# Altium project 4S SMART BMS.PrjPcb (part 4 of 6)
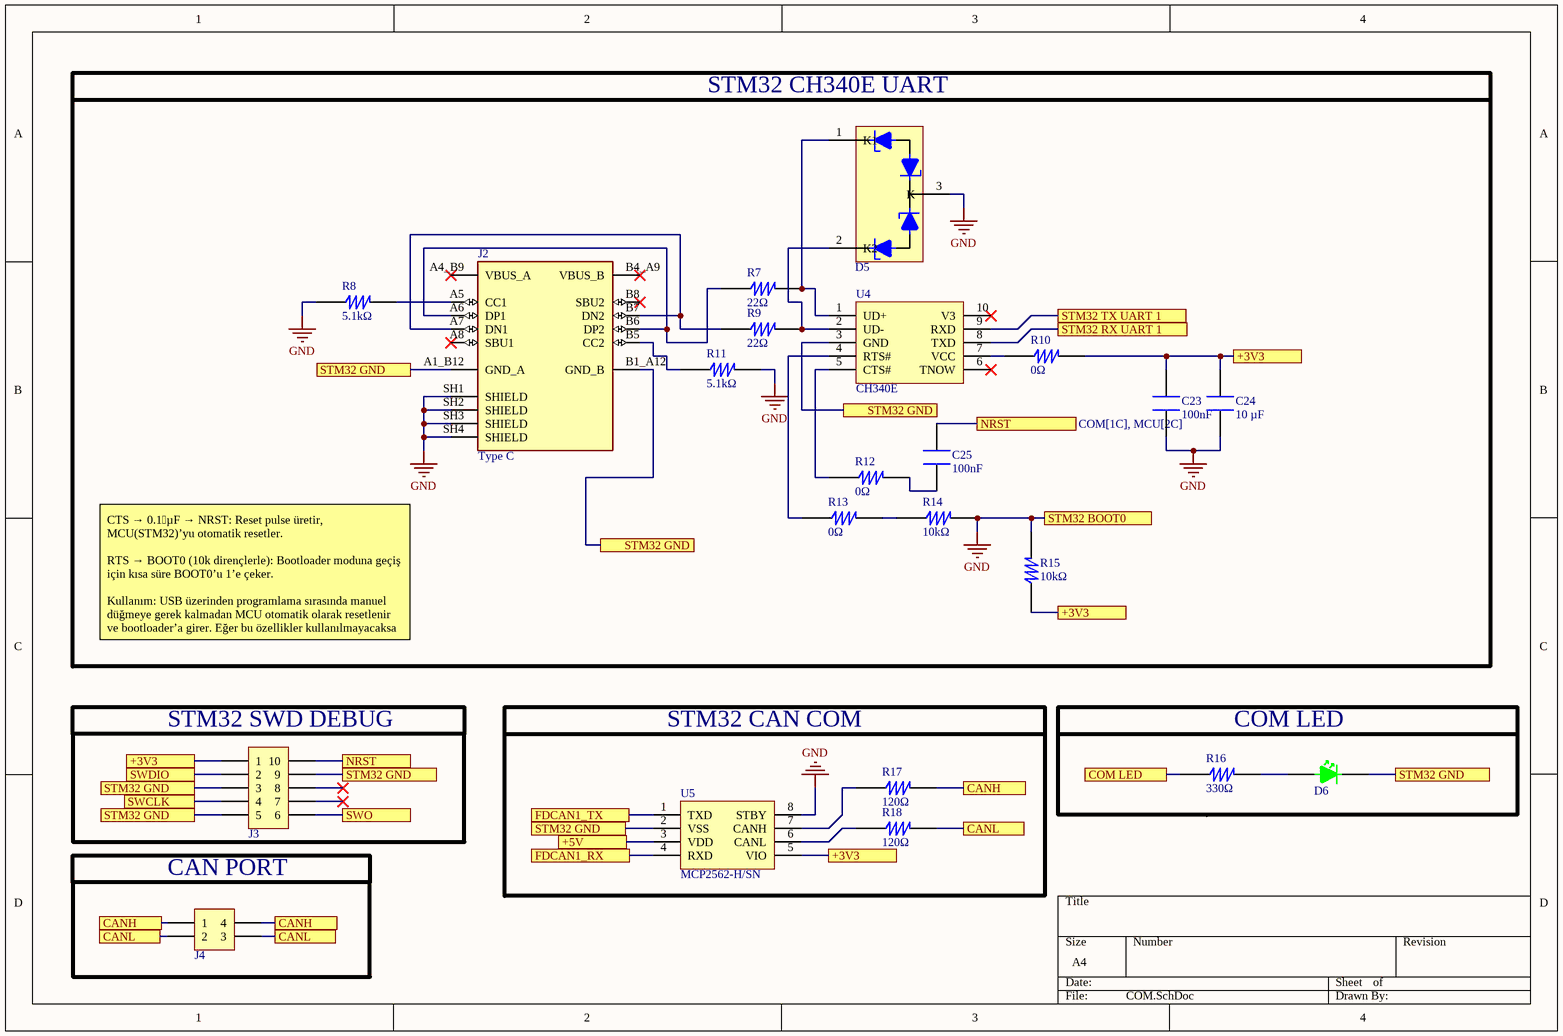
[diagram p8: COM.SchDoc]

## Sheet COM.SchDoc (continued)

### Library data of the parts
C23 C25 = CAP CER 0.1UF 6.3V 0603: 0.1 µF ±5% 6.3V Ceramic Capacitor X7R 0603 (1608 Metric); Manufacturer: KYOCERA AVX; Supplier: Arrow Electronics; Supplier Part Number: KGM15AR70J104JT; Manufacturer Part Number: KGM15AR70J104JT; RoHS: Compliant; Category: Ceramic Capacitors; Stock: 2087; Pricing: 1=0,019, 10=0,019, 25=0,019, 100=0,018, 250=0,018, 500=0,018, 1000=0,018 (USD); Dielectric Material: Ceramic; Height: 900µm; Length: 1.6mm; Lifecycle Status: Production; Max Operating Temperature: 125°C; Min Operating Temperature: -55°C; Mounting Technology: Surface Mount; Number of Terminals: 2; REACH SVHC: Yes; Voltage Rating (DC): 6.3V; Width: 810µm; ComponentLink1URL: https://datasheet.octopart.com:443/KGM15AR70J104JT-KYOCERA-AVX-datasheet-179280988.pdf?src-supplier=IHS; ComponentLink1Description: https://datasheet.octopart.com:443/KGM15AR70J104JT-KYOCERA-AVX-datasheet-179280988.pdf?src-supplier=IHS
C24 = CAP CER 10UF 50V 0805: 10 µF ±10% 50V Ceramic Capacitor X5R 0805 (2012 Metric); Series: 0805; Voltage - Rated: 50V; Tolerance: ±10%; Temperature Coefficient: X5R; Operating Temperature: -55°C ~ 85°C; Mounting Type: Surface Mount, MLCC; Package / Case: 0805 (2012 Metric); Size / Dimension: 0.079" L x 0.049" W (2.00mm x 1.25mm); Thickness (Max): 0.057" (1.45mm); ComponentLink1Description: Datasheet; ComponentLink1URL: https://mm.digikey.com/Volume0/opasdata/d220001/medias/docus/5660/3372_0805W106K500CC.pdf; ComponentLink2Description: Supplier Link; ComponentLink2URL: https://www.digikey.com/en/products/detail/nextgen-components/0805W106K500CC/18677029
D5 = DIODE TVS 14VC: 12A 14V 5.5V Bidirectional 5V SOT-23 ESD and Surge Protection (TVS/ESD) ROHS; Manufacturer: Nexperia; Manufacturer Lifecycle Status: RELEASED FOR SUPPLY; Breakdown Voltage: 7.5V; Max Breakdown Voltage: 9.5V; Number of Elements: 2; Peak Pulse Power: 130W; Supplier: Arrow Electronics; Supplier Part Number: PESD5V0S2BT,215; Manufacturer Part Number: PESD5V0S2BT,215; RoHS: Compliant; Category: TVS Diodes; Stock: 375000; Pricing: 3000=0,1023, 6000=0,102, 9000=0,101, 15000=0,099 (USD); China RoHS: Compliant; Clamping Voltage: 14V; Contact Plating: Tin; Lifecycle Status: Production; Max Operating Temperature: 150°C; Min Breakdown Voltage: 5.5V; Pins: 3; Number of Terminals: 3; Operating Supply Voltage: 5V; Polarity: Bidirectional; REACH SVHC: Yes; Reverse Standoff Voltage: 5V; Schedule B: 8536300000, 8541100050, 8541100050|8541100050|8541100050|8541100050|8541100050; ComponentLink1URL: https://datasheet.octopart.com:443/PESD5V0S2BT%2C215-Nexperia-datasheet-8331350.pdf?src-supplier=IHS; ComponentLink1Description: https://datasheet.octopart.com:443/PESD5V0S2BT%2C215-Nexperia-datasheet-8331350.pdf?src-supplier=IHS; ComponentLink2URL: https://datasheet.octopart.com:443/PESD5V0S2BT%2C215-Nexperia-datasheet-87581778.pdf?src-supplier=Nexperia; ComponentLink2Description: https://datasheet.octopart.com:443/PESD5V0S2BT%2C215-Nexperia-datasheet-87581778.pdf?src-supplier=Nexperia; ComponentLink3URL: https://datasheet.octopart.com:443/PESD5V0S2BT%2C215-Nexperia-datasheet-180924588.pdf?src-supplier=Newark; ComponentLink3Description: https://datasheet.octopart.com:443/PESD5V0S2BT%2C215-Nexperia-datasheet-180924588.pdf?src-supplier=Newark; ComponentLink4URL: http://sigma.octopart.com:80/reach_statement/NXP-Semiconductors-company-13.pdf?src-supplier=Compliance+Statements; ComponentLink4Description: http://sigma.octopart.com:80/reach_statement/NXP-Semiconductors-company-13.pdf?src-supplier=Compliance+Statements; ComponentLink5URL: http://sigma.octopart.com:80/rohs_statement/NXP-Semiconductors-company-12.pdf?src-supplier=Compliance+Statements; ComponentLink5Description: http://sigma.octopart.com:80/rohs_statement/NXP-Semiconductors-company-12.pdf?src-supplier=Compliance+Statements
D6 = LED GREEN CLEAR: LED Uni-Color Green 565nm 2-Pin Chip LED T/R; Manufacturer: Lite-On; Current: 1A; Dominant Wavelength: 569nm; Forward Current: 30mA; Forward Voltage: 2.6V; Lens Color: Clear, Colorless; Lens Style: Clear; Luminous Intensity: 1.8mcd; Number of Circuits: 1; Power Dissipation: 100mW; Reverse Voltage: 5V; Shape: Rectangular; Test Current: 10mA; Viewing Angle: 130°; Voltage: 2V; Supplier: Arrow Electronics; Supplier Part Number: LTST-C190GKT; Manufacturer Part Number: LTST-C190GKT; RoHS: Compliant; Category: LEDs; Stock: 3055; Pricing: 1=0,12, 10=0,081, 25=0,08, 100=0,056, 250=0,055, 500=0,044, 1000=0,036, 3000=0,025 (USD); Case/Package: 0603; Case Code (Imperial): 0603; Case Code (Metric): 1608; China RoHS: Compliant; Color: Green; Contact Plating: Tin; Depth: 800µm; Height: 800µm; Illumination Color: Green; Lead Free: Lead Free; Length: 1.6mm; Lens Transparency: Clear; Lifecycle Status: NRND; Max Operating Temperature: 85°C; Min Operating Temperature: -55°C; Mounting Technology: Surface Mount; Number of Elements: 1; Number of LEDs: 1; Pins: 2; Number of Terminals: 2; Peak Wavelength: 565nm; Power Rating: 100mW; Radiation Hardening: No; REACH SVHC: Yes; Schedule B: 8541402000, 8541402000|8541402000|8541402000|8541402000|8541402000; Terminal Pitch: 1.5mm; Wavelength: 569nm; Width: 800µm; ComponentLink1URL: https://datasheet.octopart.com:443/LTST-C190GKT-Lite-On-datasheet-66499085.pdf?src-supplier=IHS; ComponentLink1Description: https://datasheet.octopart.com:443/LTST-C190GKT-Lite-On-datasheet-66499085.pdf?src-supplier=IHS; ComponentLink2URL: https://datasheet.octopart.com:443/LTST-C190GKT-Lite-On-datasheet-158530.pdf?src-supplier=Electro+Sonic; ComponentLink2Description: https://datasheet.octopart.com:443/LTST-C190GKT-Lite-On-datasheet-158530.pdf?src-supplier=Electro+Sonic; ComponentLink3URL: https://datasheet.octopart.com:443/LTST-C190GKT-Lite-On-datasheet-87079182.pdf?src-supplier=Upverter; ComponentLink3Description: https://datasheet.octopart.com:443/LTST-C190GKT-Lite-On-datasheet-87079182.pdf?src-supplier=Upverter; ComponentLink4URL: https://datasheet.octopart.com:443/LTST-C190GKT-Lite-On-datasheet-7279162.pdf?src-supplier=Future+Electronics; ComponentLink4Description: https://datasheet.octopart.com:443/LTST-C190GKT-Lite-On-datasheet-7279162.pdf?src-supplier=Future+Electronics; ComponentLink5URL: https://datasheet.octopart.com:443/LTST-C190GKT-Lite-On-datasheet-86397319.pdf?src-supplier=Future+Electronics; ComponentLink5Description: https://datasheet.octopart.com:443/LTST-C190GKT-Lite-On-datasheet-86397319.pdf?src-supplier=Future+Electronics; ComponentLink6URL: https://datasheet.octopart.com:443/LTST-C190GKT-Lite-On-datasheet-93383.pdf?src-supplier=DigiKey; ComponentLink6Description: https://datasheet.octopart.com:443/LTST-C190GKT-Lite-On-datasheet-93383.pdf?src-supplier=DigiKey; ComponentLink7URL: https://datasheet.octopart.com:443/LTST-C190GKT-Lite-On-datasheet-14174996.pdf?src-supplier=iiiC; ComponentLink7Description: https://datasheet.octopart.com:443/LTST-C190GKT-Lite-On-datasheet-14174996.pdf?src-supplier=iiiC; ComponentLink8URL: https://datasheet.octopart.com:443/LTST-C190GKT-Lite-On-datasheet-62340971.pdf?src-supplier=TME; ComponentLink8Description: https://datasheet.octopart.com:443/LTST-C190GKT-Lite-On-datasheet-62340971.pdf?src-supplier=TME
J2 = TYPE C USB2.0: USB-C (USB TYPE-C) USB 2.0 Receptacle Connector 24 (16+8 Dummy) Position Surface Mount, Right Angle; Through Hole; Manufacturer: Amphenol; Supplier: Arrow Electronics; Supplier Part Number: GSB1C41110SSHR; Manufacturer Part Number: GSB1C41110SSHR; Category: Connectors; Pricing: 8000=0,2931, 16000=0,29, 24000=0,287, 40000=0,284, 48000=0,282, 96000=0,279, 120000=0,276, 200000=0,273, 240000=0,27 (USD)
J3 = HEADER 2×5 pin: Pin Header, Precision Machined Terminal, Board-to-Board, 2.54 mm, 2 Rows, 10 Contacts, Through Hole; Manufacturer: Samtec; Manufacturer Lifecycle Status: PRODUCTION; Connector Type: Socket; Gender: Receptacle; Number of Contacts: 10; Pitch: 2.54mm; Supplier: Arrow Electronics; Supplier Part Number: TD-105-T-A; Manufacturer Part Number: TD-105-T-A; RoHS: Compliant; Category: Headers and Wire Housings; Pricing: 1=1,88, 50=1,46, 100=1,18, 500=1, 1000=0,79, 2000=0,73, 5000=0,59, 10000=0,45 (USD); Color: Black; Contact Material: Brass; Contact Mating Length: 4.2164mm; Contact Plating: Tin; Height: 2.54mm; Housing Color: Black; Housing Material: Plastic; Lead Free: Lead Free; Length: 12.7mm; Lifecycle Status: Production; Mounting Technology: Through Hole; Number of Positions: 10; Number of Rows: 2; Packaging: Bulk; Radiation Hardening: No; REACH SVHC: No; Row Spacing: 2.54mm; Termination: Solder; Width: 5.08mm; ComponentLink1URL: https://datasheet.octopart.com:443/TD-105-T-A-Samtec-datasheet-97310231.pdf?src-supplier=Sager+Electronics; ComponentLink1Description: https://datasheet.octopart.com:443/TD-105-T-A-Samtec-datasheet-97310231.pdf?src-supplier=Sager+Electronics; ComponentLink2URL: https://datasheet.octopart.com:443/TD-105-T-A-Samtec-datasheet-150856305.pdf?src-supplier=Sager+Electronics; ComponentLink2Description: https://datasheet.octopart.com:443/TD-105-T-A-Samtec-datasheet-150856305.pdf?src-supplier=Sager+Electronics; ComponentLink3URL: https://datasheet.octopart.com:443/TD-105-T-A-Samtec-datasheet-179090728.pdf?src-supplier=Sager+Electronics; ComponentLink3Description: https://datasheet.octopart.com:443/TD-105-T-A-Samtec-datasheet-179090728.pdf?src-supplier=Sager+Electronics; ComponentLink4URL: https://datasheet.octopart.com:443/TD-105-T-A-Samtec-datasheet-129019458.pdf?src-supplier=Electro+Sonic; ComponentLink4Description: https://datasheet.octopart.com:443/TD-105-T-A-Samtec-datasheet-129019458.pdf?src-supplier=Electro+Sonic; ComponentLink5URL: https://datasheet.octopart.com:443/TD-105-T-A-Samtec-datasheet-41643126.pdf?src-supplier=Farnell; ComponentLink5Description: https://datasheet.octopart.com:443/TD-105-T-A-Samtec-datasheet-41643126.pdf?src-supplier=Farnell; ComponentLink6URL: https://datasheet.octopart.com:443/TD-105-T-A-Samtec-datasheet-37173861.pdf?src-supplier=Farnell; ComponentLink6Description: https://datasheet.octopart.com:443/TD-105-T-A-Samtec-datasheet-37173861.pdf?src-supplier=Farnell; ComponentLink7URL: https://datasheet.octopart.com:443/TD-105-T-A-Samtec-datasheet-8466599.pdf?src-supplier=Farnell; ComponentLink7Description: https://datasheet.octopart.com:443/TD-105-T-A-Samtec-datasheet-8466599.pdf?src-supplier=Farnell; ComponentLink8URL: https://datasheet.octopart.com:443/TD-105-T-A-Samtec-datasheet-175953447.pdf?src-supplier=JRH+Electronics; ComponentLink8Description: https://datasheet.octopart.com:443/TD-105-T-A-Samtec-datasheet-175953447.pdf?src-supplier=JRH+Electronics; ComponentLink9URL: https://datasheet.octopart.com:443/TD-105-T-A-Samtec-datasheet-116539057.pdf?src-supplier=Toby+Electronics; ComponentLink9Description: https://datasheet.octopart.com:443/TD-105-T-A-Samtec-datasheet-116539057.pdf?src-supplier=Toby+Electronics; ComponentLink10URL: https://datasheet.octopart.com:443/TD-105-T-A-Samtec-datasheet-116536282.pdf?src-supplier=Toby+Electronics; ComponentLink10Description: https://datasheet.octopart.com:443/TD-105-T-A-Samtec-datasheet-116536282.pdf?src-supplier=Toby+Electronics; ComponentLink11URL: https://datasheet.octopart.com:443/TD-105-T-A-Samtec-datasheet-21214653.pdf?src-supplier=Newark; ComponentLink11Description: https://datasheet.octopart.com:443/TD-105-T-A-Samtec-datasheet-21214653.pdf?src-supplier=Newark
J4 = HEADER 2X2 pin: CONN HEADER VERT 4POS 2.54MM; Manufacturer: Samtec; Manufacturer Lifecycle Status: PRODUCTION; Number of Contacts: 4; Supplier: Farnell; Supplier Part Number: 3687780; Manufacturer Part Number: TD-102-T-A; RoHS: Compliant; Category: Headers and Wire Housings; Pricing: 100=0,565 (EUR); Color: Black; Contact Material: Brass; Contact Mating Length: 4.2164mm; Contact Plating: Tin; Height: 2.54mm; Housing Color: Black; Housing Material: Plastic; Lead Free: Lead Free; Length: 5.08mm; Lifecycle Status: Production; Mounting Technology: Through Hole; Number of Positions: 4; Number of Rows: 2; Packaging: Bulk; Pitch: 2.54mm; Radiation Hardening: No; REACH SVHC: No; Row Spacing: 2.54mm; Termination: Solder; Width: 5.08mm; ComponentLink1URL: https://datasheet.octopart.com:443/TD-102-T-A-Samtec-datasheet-97310231.pdf?src-supplier=Samtec; ComponentLink1Description: https://datasheet.octopart.com:443/TD-102-T-A-Samtec-datasheet-97310231.pdf?src-supplier=Samtec; ComponentLink2URL: https://datasheet.octopart.com:443/TD-102-T-A-Samtec-datasheet-150856305.pdf?src-supplier=Sager+Electronics; ComponentLink2Description: https://datasheet.octopart.com:443/TD-102-T-A-Samtec-datasheet-150856305.pdf?src-supplier=Sager+Electronics; ComponentLink3URL: https://datasheet.octopart.com:443/TD-102-T-A-Samtec-datasheet-129019458.pdf?src-supplier=Sager+Electronics; ComponentLink3Description: https://datasheet.octopart.com:443/TD-102-T-A-Samtec-datasheet-129019458.pdf?src-supplier=Sager+Electronics; ComponentLink4URL: https://datasheet.octopart.com:443/TD-102-T-A-Samtec-datasheet-179090728.pdf?src-supplier=Sager+Electronics; ComponentLink4Description: https://datasheet.octopart.com:443/TD-102-T-A-Samtec-datasheet-179090728.pdf?src-supplier=Sager+Electronics; ComponentLink5URL: https://datasheet.octopart.com:443/TD-102-T-A-Samtec-datasheet-41643126.pdf?src-supplier=Farnell; ComponentLink5Description: https://datasheet.octopart.com:443/TD-102-T-A-Samtec-datasheet-41643126.pdf?src-supplier=Farnell; ComponentLink6URL: https://datasheet.octopart.com:443/TD-102-T-A-Samtec-datasheet-37173861.pdf?src-supplier=Farnell; ComponentLink6Description: https://datasheet.octopart.com:443/TD-102-T-A-Samtec-datasheet-37173861.pdf?src-supplier=Farnell; ComponentLink7URL: https://datasheet.octopart.com:443/TD-102-T-A-Samtec-datasheet-8466599.pdf?src-supplier=Farnell; ComponentLink7Description: https://datasheet.octopart.com:443/TD-102-T-A-Samtec-datasheet-8466599.pdf?src-supplier=Farnell; ComponentLink8URL: https://datasheet.octopart.com:443/TD-102-T-A-Samtec-datasheet-21214653.pdf?src-supplier=Newark; ComponentLink8Description: https://datasheet.octopart.com:443/TD-102-T-A-Samtec-datasheet-21214653.pdf?src-supplier=Newark
R7 R9 = RES 22 OHM 1/10W 0603: 22 Ohms ±1% 0.1W, 1/10W Chip Resistor 0603 (1608 Metric) Automotive AEC-Q200 Thick Film; Manufacturer: Stackpole Electronics; Max Power Dissipation: 100mW; Temperature Coefficient: 100ppm/°C; Voltage Rating: 75V; Supplier: Arrow Electronics; Supplier Part Number: RMCF0603FT22R0; Manufacturer Part Number: RMCF0603FT22R0; RoHS: Compliant; Category: Chip SMD Resistors; Stock: 5000; Pricing: 5000=0,002 (USD); Case/Package: 0603; Case Code (Imperial): 0603; Case Code (Metric): 1608; China RoHS: Non-Compliant; Composition: Thick Film; Contact Plating: Tin; Features: Automotive AEC-Q200; Height: 450µm; Length: 1.5494mm; Lifecycle Status: Production; Max Operating Temperature: 155°C; Min Operating Temperature: -55°C; Mounting Technology: Surface Mount; Number of Terminals: 2; Number of Terminations: 2; Packaging: Digi-Reel®; Power Dissipation: 100mW; Power Rating: 100mW; Radiation Hardening: No; REACH SVHC: Yes; Schedule B: 8533210045, 8533210045|8533210045, 8533210045|8533210045|8533210045, 8533210045|8533210045|8533210045|8533210045; Tolerance: 1%; Width: 800µm; Working Voltage: 75V; ComponentLink1URL: https://datasheet.octopart.com:443/RMCF0603FT22R0-Stackpole-Electronics-datasheet-182148065.pdf?src-supplier=IHS; ComponentLink1Description: https://datasheet.octopart.com:443/RMCF0603FT22R0-Stackpole-Electronics-datasheet-182148065.pdf?src-supplier=IHS; ComponentLink2URL: https://datasheet.octopart.com:443/RMCF0603FT22R0-Stackpole-Electronics-datasheet-28504820.pdf?src-supplier=Upverter; ComponentLink2Description: https://datasheet.octopart.com:443/RMCF0603FT22R0-Stackpole-Electronics-datasheet-28504820.pdf?src-supplier=Upverter; ComponentLink3URL: https://datasheet.octopart.com:443/RMCF0603FT22R0-Stackpole-Electronics-datasheet-141193804.pdf?src-supplier=Master+Electronics; ComponentLink3Description: https://datasheet.octopart.com:443/RMCF0603FT22R0-Stackpole-Electronics-datasheet-141193804.pdf?src-supplier=Master+Electronics; ComponentLink4URL: https://datasheet.octopart.com:443/RMCF0603FT22R0-Stackpole-Electronics-datasheet-189104163.pdf?src-supplier=Master+Electronics; ComponentLink4Description: https://datasheet.octopart.com:443/RMCF0603FT22R0-Stackpole-Electronics-datasheet-189104163.pdf?src-supplier=Master+Electronics; ComponentLink5URL: https://datasheet.octopart.com:443/RMCF0603FT22R0-Stackpole-Electronics-datasheet-116606903.pdf?src-supplier=Master+Electronics; ComponentLink5Description: https://datasheet.octopart.com:443/RMCF0603FT22R0-Stackpole-Electronics-datasheet-116606903.pdf?src-supplier=Master+Electronics; ComponentLink6URL: https://datasheet.octopart.com:443/RMCF0603FT22R0-Stackpole-Electronics-datasheet-62091608.pdf?src-supplier=Stackpole+Electronics; ComponentLink6Description: https://datasheet.octopart.com:443/RMCF0603FT22R0-Stackpole-Electronics-datasheet-62091608.pdf?src-supplier=Stackpole+Electronics; ComponentLink7URL: https://datasheet.octopart.com:443/RMCF0603FT22R0-Stackpole-Electronics-datasheet-12534581.pdf?src-supplier=Stackpole+Electronics; ComponentLink7Description: https://datasheet.octopart.com:443/RMCF0603FT22R0-Stackpole-Electronics-datasheet-12534581.pdf?src-supplier=Stackpole+Electronics; ComponentLink8URL: https://datasheet.octopart.com:443/RMCF0603FT22R0-Stackpole-Electronics-datasheet-10788263.pdf?src-supplier=Stackpole+Electronics; ComponentLink8Description: https://datasheet.octopart.com:443/RMCF0603FT22R0-Stackpole-Electronics-datasheet-10788263.pdf?src-supplier=Stackpole+Electronics; ComponentLink9URL: http://sigma.octopart.com:80/15940719/materials_sheet/Stackpole-Electronics-RMCF0603FT22R0.pdf?src-supplier=Compliance+Statements; ComponentLink9Description: http://sigma.octopart.com:80/15940719/materials_sheet/Stackpole-Electronics-RMCF0603FT22R0.pdf?src-supplier=Compliance+Statements; ComponentLink10URL: http://sigma.octopart.com:80/141158212/rohs_statement/Stackpole-Electronics-RMCF0603FT22R0.pdf?src-supplier=Compliance+Statements; ComponentLink10Description: http://sigma.octopart.com:80/141158212/rohs_statement/Stackpole-Electronics-RMCF0603FT22R0.pdf?src-supplier=Compliance+Statements; ComponentLink11URL: http://sigma.octopart.com:80/141158211/reach_statement/Stackpole-Electronics-RMCF0603FT22R0.pdf?src-supplier=Compliance+Statements; ComponentLink11Description: http://sigma.octopart.com:80/141158211/reach_statement/Stackpole-Electronics-RMCF0603FT22R0.pdf?src-supplier=Compliance+Statements
R8 R11 = RES 5.1K OHM 1/10W 0603: RES 5.1K OHM 1% 1/10W 0603; Manufacturer: Yageo Group; Max Power Dissipation: 100mW; Temperature Coefficient: 100ppm/°C; Voltage Rating: 75V; Voltage Rating (DC): 50V; Supplier: Farnell; Supplier Part Number: 3495881; Manufacturer Part Number: RC0603FR-075K1L; RoHS: Compliant; Category: Chip SMD Resistors; Stock: 102219; Pricing: 10=0,0085, 100=0,0076, 500=0,0065, 1000=0,005, 2500=0,0039 (EUR); Case/Package: 0603; Case Code (Imperial): 0603; China RoHS: Non-Compliant; Composition: Thick Film; Depth: 800µm; Features: Moisture Resistant; Height: 450µm; Lead Free: Lead Free; Lifecycle Status: Production; Max Operating Temperature: 155°C; Military Standard: Not; Min Operating Temperature: -55°C; Mounting Technology: Surface Mount; Pins: 2; Number of Terminals: 2; Number of Terminations: 2; Packaging: Tape & Reel; Power Dissipation: 100mW; Power Rating: 100mW; REACH SVHC: Yes; Schedule B: 8533210045, 8533210045|8533210045, 8533210045|8533210045|8533210045, 8533210045|8533210045|8533210045|8533210045; Termination: SMD/SMT; Tolerance: 1%; Width: 800µm; Working Voltage: 75V; ComponentLink1URL: https://datasheet.octopart.com:443/RC0603FR-075K1L-Yageo-datasheet-175887523.pdf?src-supplier=IHS; ComponentLink1Description: https://datasheet.octopart.com:443/RC0603FR-075K1L-Yageo-datasheet-175887523.pdf?src-supplier=IHS; ComponentLink2URL: https://datasheet.octopart.com:443/RC0603FR-075K1L-Yageo-datasheet-103092701.pdf?src-supplier=Upverter; ComponentLink2Description: https://datasheet.octopart.com:443/RC0603FR-075K1L-Yageo-datasheet-103092701.pdf?src-supplier=Upverter; ComponentLink3URL: https://datasheet.octopart.com:443/RC0603FR-075K1L-Yageo-datasheet-8328172.pdf?src-supplier=Farnell; ComponentLink3Description: https://datasheet.octopart.com:443/RC0603FR-075K1L-Yageo-datasheet-8328172.pdf?src-supplier=Farnell; ComponentLink4URL: https://datasheet.octopart.com:443/RC0603FR-075K1L-Yageo-datasheet-62067350.pdf?src-supplier=Farnell; ComponentLink4Description: https://datasheet.octopart.com:443/RC0603FR-075K1L-Yageo-datasheet-62067350.pdf?src-supplier=Farnell; ComponentLink5URL: https://datasheet.octopart.com:443/RC0603FR-075K1L-Yageo-datasheet-34211833.pdf?src-supplier=element14+APAC; ComponentLink5Description: https://datasheet.octopart.com:443/RC0603FR-075K1L-Yageo-datasheet-34211833.pdf?src-supplier=element14+APAC; ComponentLink6URL: https://datasheet.octopart.com:443/RC0603FR-075K1L-Yageo-datasheet-164759695.pdf?src-supplier=Future+Electronics; ComponentLink6Description: https://datasheet.octopart.com:443/RC0603FR-075K1L-Yageo-datasheet-164759695.pdf?src-supplier=Future+Electronics; ComponentLink7URL: https://datasheet.octopart.com:443/RC0603FR-075K1L-Yageo-datasheet-137700087.pdf?src-supplier=Future+Electronics; ComponentLink7Description: https://datasheet.octopart.com:443/RC0603FR-075K1L-Yageo-datasheet-137700087.pdf?src-supplier=Future+Electronics; ComponentLink8URL: https://datasheet.octopart.com:443/RC0603FR-075K1L-Yageo-datasheet-15599030.pdf?src-supplier=Future+Electronics; ComponentLink8Description: https://datasheet.octopart.com:443/RC0603FR-075K1L-Yageo-datasheet-15599030.pdf?src-supplier=Future+Electronics; ComponentLink9URL: https://datasheet.octopart.com:443/RC0603FR-075K1L-Yageo-datasheet-12596169.pdf?src-supplier=Future+Electronics; ComponentLink9Description: https://datasheet.octopart.com:443/RC0603FR-075K1L-Yageo-datasheet-12596169.pdf?src-supplier=Future+Electronics; ComponentLink10URL: https://datasheet.octopart.com:443/RC0603FR-075K1L-Yageo-datasheet-503470.pdf?src-supplier=Future+Electronics; ComponentLink10Description: https://datasheet.octopart.com:443/RC0603FR-075K1L-Yageo-datasheet-503470.pdf?src-supplier=Future+Electronics; ComponentLink11URL: https://datasheet.octopart.com:443/RC0603FR-075K1L-Yageo-datasheet-148775077.pdf?src-supplier=TME; ComponentLink11Description: https://datasheet.octopart.com:443/RC0603FR-075K1L-Yageo-datasheet-148775077.pdf?src-supplier=TME; ComponentLink12URL: https://datasheet.octopart.com:443/RC0603FR-075K1L-Yageo-datasheet-79472498.pdf?src-supplier=Megastar; ComponentLink12Description: https://datasheet.octopart.com:443/RC0603FR-075K1L-Yageo-datasheet-79472498.pdf?src-supplier=Megastar; ComponentLink13URL: https://datasheet.octopart.com/RC0603FR-075K1L-Yageo-datasheet-73766026.pdf; ComponentLink13Description: https://datasheet.octopart.com/RC0603FR-075K1L-Yageo-datasheet-73766026.pdf; ComponentLink14URL: https://datasheet.octopart.com:443/RC0603FR-075K1L-Yageo-datasheet-118562.pdf?src-supplier=DigiKey; ComponentLink14Description: https://datasheet.octopart.com:443/RC0603FR-075K1L-Yageo-datasheet-118562.pdf?src-supplier=DigiKey; ComponentLink15URL: http://sigma.octopart.com:80/rohs_statement/Yageo-company-2.pdf?src-supplier=Compliance+Statements; ComponentLink15Description: http://sigma.octopart.com:80/rohs_statement/Yageo-company-2.pdf?src-supplier=Compliance+Statements; ComponentLink16URL: http://sigma.octopart.com:80/conflict_mineral_statement/Yageo-company-3.pdf?src-supplier=Compliance+Statements; ComponentLink16Description: http://sigma.octopart.com:80/conflict_mineral_statement/Yageo-company-3.pdf?src-supplier=Compliance+Statements
R10 R12 R13 = RES 0 OHM JUMPER 1/10W 0603: RES 0 OHM JUMPER 1/10W 0603 Chip Resistor 0603 (1608 Metric) Automotive AEC-Q200 Thick Film; Manufacturer: Stackpole Electronics; Current Rating: 1A; Max Power Dissipation: 100mW; Voltage Rating: 75V; Supplier: Arrow Electronics; Supplier Part Number: RMCF0603ZT0R00; Manufacturer Part Number: RMCF0603ZT0R00; RoHS: Compliant; Category: Chip SMD Resistors; Stock: 1355000; Pricing: 55000=0,0014 (USD); Case/Package: 0603; Case Code (Imperial): 0603; Case Code (Metric): 1608; China RoHS: Non-Compliant; Composition: Thick Film; Contact Plating: Tin; Depth: 800µm; Features: Automotive AEC-Q200; Height: 450µm; Lead Free: Lead Free; Length: 1.55mm; Lifecycle Status: Production; Max Operating Temperature: 155°C; Military Standard: Not; Min Operating Temperature: -55°C; Mounting Technology: Surface Mount; Number of Terminals: 2; Number of Terminations: 2; Packaging: Cut Tape (CT); Power Dissipation: 100mW; Power Rating: 100mW; Radiation Hardening: No; REACH SVHC: Yes; Schedule B: 8533210045, 8533210045|8533210045, 8533210045|8533210045|8533210045, 8533210045|8533210045|8533210045|8533210045; Width: 800µm; Working Voltage: 75V; ComponentLink1URL: https://datasheet.octopart.com:443/RMCF0603ZT0R00-Stackpole-Electronics-datasheet-182148075.pdf?src-supplier=IHS; ComponentLink1Description: https://datasheet.octopart.com:443/RMCF0603ZT0R00-Stackpole-Electronics-datasheet-182148075.pdf?src-supplier=IHS; ComponentLink2URL: https://datasheet.octopart.com:443/RMCF0603ZT0R00-Stackpole-Electronics-datasheet-141193804.pdf?src-supplier=Stackpole+Electronics; ComponentLink2Description: https://datasheet.octopart.com:443/RMCF0603ZT0R00-Stackpole-Electronics-datasheet-141193804.pdf?src-supplier=Stackpole+Electronics; ComponentLink3URL: https://datasheet.octopart.com:443/RMCF0603ZT0R00-Stackpole-Electronics-datasheet-62091608.pdf?src-supplier=Stackpole+Electronics; ComponentLink3Description: https://datasheet.octopart.com:443/RMCF0603ZT0R00-Stackpole-Electronics-datasheet-62091608.pdf?src-supplier=Stackpole+Electronics; ComponentLink4URL: https://datasheet.octopart.com:443/RMCF0603ZT0R00-Stackpole-Electronics-datasheet-12534581.pdf?src-supplier=Stackpole+Electronics; ComponentLink4Description: https://datasheet.octopart.com:443/RMCF0603ZT0R00-Stackpole-Electronics-datasheet-12534581.pdf?src-supplier=Stackpole+Electronics; ComponentLink5URL: https://datasheet.octopart.com:443/RMCF0603ZT0R00-Stackpole-Electronics-datasheet-10788263.pdf?src-supplier=Stackpole+Electronics; ComponentLink5Description: https://datasheet.octopart.com:443/RMCF0603ZT0R00-Stackpole-Electronics-datasheet-10788263.pdf?src-supplier=Stackpole+Electronics; ComponentLink6URL: https://datasheet.octopart.com:443/RMCF0603ZT0R00-Stackpole-Electronics-datasheet-28504820.pdf?src-supplier=Upverter; ComponentLink6Description: https://datasheet.octopart.com:443/RMCF0603ZT0R00-Stackpole-Electronics-datasheet-28504820.pdf?src-supplier=Upverter; ComponentLink7URL: https://datasheet.octopart.com:443/RMCF0603ZT0R00-Stackpole-Electronics-datasheet-116606903.pdf?src-supplier=Upverter; ComponentLink7Description: https://datasheet.octopart.com:443/RMCF0603ZT0R00-Stackpole-Electronics-datasheet-116606903.pdf?src-supplier=Upverter; ComponentLink8URL: https://datasheet.octopart.com:443/RMCF0603ZT0R00-Stackpole-Electronics-datasheet-154799224.pdf?src-supplier=Master+Electronics; ComponentLink8Description: https://datasheet.octopart.com:443/RMCF0603ZT0R00-Stackpole-Electronics-datasheet-154799224.pdf?src-supplier=Master+Electronics; ComponentLink9URL: https://datasheet.octopart.com:443/RMCF0603ZT0R00-Stackpole-Electronics-datasheet-11546843.pdf?src-supplier=Arrow+Electronics; ComponentLink9Description: https://datasheet.octopart.com:443/RMCF0603ZT0R00-Stackpole-Electronics-datasheet-11546843.pdf?src-supplier=Arrow+Electronics; ComponentLink10URL: https://datasheet.octopart.com:443/RMCF0603ZT0R00-Stackpole-Electronics-datasheet-11547379.pdf?src-supplier=Future+Electronics; ComponentLink10Description: https://datasheet.octopart.com:443/RMCF0603ZT0R00-Stackpole-Electronics-datasheet-11547379.pdf?src-supplier=Future+Electronics; ComponentLink11URL: https://datasheet.octopart.com:443/RMCF0603ZT0R00-Stackpole-Electronics-datasheet-8359789.pdf?src-supplier=Future+Electronics; ComponentLink11Description: https://datasheet.octopart.com:443/RMCF0603ZT0R00-Stackpole-Electronics-datasheet-8359789.pdf?src-supplier=Future+Electronics; ComponentLink12URL: https://datasheet.octopart.com:443/RMCF0603ZT0R00-Stackpole-Electronics-datasheet-8324226.pdf?src-supplier=Future+Electronics; ComponentLink12Description: https://datasheet.octopart.com:443/RMCF0603ZT0R00-Stackpole-Electronics-datasheet-8324226.pdf?src-supplier=Future+Electronics; ComponentLink13URL: http://sigma.octopart.com:80/15940719/materials_sheet/Stackpole-Electronics-RMCF0603ZT0R00.pdf?src-supplier=Compliance+Statements; ComponentLink13Description: http://sigma.octopart.com:80/15940719/materials_sheet/Stackpole-Electronics-RMCF0603ZT0R00.pdf?src-supplier=Compliance+Statements; ComponentLink14URL: http://sigma.octopart.com:80/141158211/reach_statement/Stackpole-Electronics-RMCF0603ZT0R00.pdf?src-supplier=Compliance+Statements; ComponentLink14Description: http://sigma.octopart.com:80/141158211/reach_statement/Stackpole-Electronics-RMCF0603ZT0R00.pdf?src-supplier=Compliance+Statements; ComponentLink15URL: http://sigma.octopart.com:80/141158212/rohs_statement/Stackpole-Electronics-RMCF0603ZT0R00.pdf?src-supplier=Compliance+Statements; ComponentLink15Description: http://sigma.octopart.com:80/141158212/rohs_statement/Stackpole-Electronics-RMCF0603ZT0R00.pdf?src-supplier=Compliance+Statements
R14 R15 = RES 10K OHM 1/10W 0603: RES 10K OHM 1% 1/10W 0603; Manufacturer: Stackpole Electronics; Max Power Dissipation: 100mW; Temperature Coefficient: 100ppm/°C; Voltage Rating: 75V; Supplier: Arrow Electronics; Supplier Part Number: RMCF0603FT10K0; Manufacturer Part Number: RMCF0603FT10K0; RoHS: Compliant; Category: Chip SMD Resistors; Stock: 2390000; Pricing: 50000=0,0018 (USD); Case/Package: 0603; Case Code (Imperial): 0603; Case Code (Metric): 1608; China RoHS: Non-Compliant; Composition: Thick Film; Contact Plating: Tin; Depth: 800µm; Features: Automotive AEC-Q200; Height: 450µm; Lead Free: Lead Free; Length: 1.55mm; Lifecycle Status: Production; Max Operating Temperature: 155°C; Military Standard: Not; Min Operating Temperature: -55°C; Mounting Technology: Surface Mount; Number of Terminals: 2; Number of Terminations: 2; Packaging: Cut Tape (CT); Power Dissipation: 100mW; Power Rating: 100mW; Radiation Hardening: No; REACH SVHC: Yes; Schedule B: 8533210045, 8533210045|8533210045, 8533210045|8533210045|8533210045, 8533210045|8533210045|8533210045|8533210045; Tolerance: 1%; Width: 800µm; Working Voltage: 75V; ComponentLink1URL: https://datasheet.octopart.com:443/RMCF0603FT10K0-Stackpole-Electronics-datasheet-182148065.pdf?src-supplier=IHS; ComponentLink1Description: https://datasheet.octopart.com:443/RMCF0603FT10K0-Stackpole-Electronics-datasheet-182148065.pdf?src-supplier=IHS; ComponentLink2URL: https://datasheet.octopart.com:443/RMCF0603FT10K0-Stackpole-Electronics-datasheet-28504820.pdf?src-supplier=Upverter; ComponentLink2Description: https://datasheet.octopart.com:443/RMCF0603FT10K0-Stackpole-Electronics-datasheet-28504820.pdf?src-supplier=Upverter; ComponentLink3URL: https://datasheet.octopart.com:443/RMCF0603FT10K0-Stackpole-Electronics-datasheet-141193804.pdf?src-supplier=Stackpole+Electronics; ComponentLink3Description: https://datasheet.octopart.com:443/RMCF0603FT10K0-Stackpole-Electronics-datasheet-141193804.pdf?src-supplier=Stackpole+Electronics; ComponentLink4URL: https://datasheet.octopart.com:443/RMCF0603FT10K0-Stackpole-Electronics-datasheet-62091608.pdf?src-supplier=Stackpole+Electronics; ComponentLink4Description: https://datasheet.octopart.com:443/RMCF0603FT10K0-Stackpole-Electronics-datasheet-62091608.pdf?src-supplier=Stackpole+Electronics; ComponentLink5URL: https://datasheet.octopart.com:443/RMCF0603FT10K0-Stackpole-Electronics-datasheet-12534581.pdf?src-supplier=Stackpole+Electronics; ComponentLink5Description: https://datasheet.octopart.com:443/RMCF0603FT10K0-Stackpole-Electronics-datasheet-12534581.pdf?src-supplier=Stackpole+Electronics; ComponentLink6URL: https://datasheet.octopart.com:443/RMCF0603FT10K0-Stackpole-Electronics-datasheet-10788263.pdf?src-supplier=Stackpole+Electronics; ComponentLink6Description: https://datasheet.octopart.com:443/RMCF0603FT10K0-Stackpole-Electronics-datasheet-10788263.pdf?src-supplier=Stackpole+Electronics; ComponentLink7URL: https://datasheet.octopart.com:443/RMCF0603FT10K0-Stackpole-Electronics-datasheet-155966809.pdf?src-supplier=Electro+Sonic; ComponentLink7Description: https://datasheet.octopart.com:443/RMCF0603FT10K0-Stackpole-Electronics-datasheet-155966809.pdf?src-supplier=Electro+Sonic; ComponentLink8URL: https://datasheet.octopart.com:443/RMCF0603FT10K0-Stackpole-Electronics-datasheet-189104164.pdf?src-supplier=Master+Electronics; ComponentLink8Description: https://datasheet.octopart.com:443/RMCF0603FT10K0-Stackpole-Electronics-datasheet-189104164.pdf?src-supplier=Master+Electronics; ComponentLink9URL: https://datasheet.octopart.com:443/RMCF0603FT10K0-Stackpole-Electronics-datasheet-154799224.pdf?src-supplier=Master+Electronics; ComponentLink9Description: https://datasheet.octopart.com:443/RMCF0603FT10K0-Stackpole-Electronics-datasheet-154799224.pdf?src-supplier=Master+Electronics; ComponentLink10URL: https://datasheet.octopart.com:443/RMCF0603FT10K0-Stackpole-Electronics-datasheet-11546843.pdf?src-supplier=Arrow+Electronics; ComponentLink10Description: https://datasheet.octopart.com:443/RMCF0603FT10K0-Stackpole-Electronics-datasheet-11546843.pdf?src-supplier=Arrow+Electronics; ComponentLink11URL: https://datasheet.octopart.com:443/RMCF0603FT10K0-Stackpole-Electronics-datasheet-11547379.pdf?src-supplier=Future+Electronics; ComponentLink11Description: https://datasheet.octopart.com:443/RMCF0603FT10K0-Stackpole-Electronics-datasheet-11547379.pdf?src-supplier=Future+Electronics; ComponentLink12URL: https://datasheet.octopart.com:443/RMCF0603FT10K0-Stackpole-Electronics-datasheet-8359789.pdf?src-supplier=Future+Electronics; ComponentLink12Description: https://datasheet.octopart.com:443/RMCF0603FT10K0-Stackpole-Electronics-datasheet-8359789.pdf?src-supplier=Future+Electronics; ComponentLink13URL: https://datasheet.octopart.com:443/RMCF0603FT10K0-Stackpole-Electronics-datasheet-8324226.pdf?src-supplier=Future+Electronics; ComponentLink13Description: https://datasheet.octopart.com:443/RMCF0603FT10K0-Stackpole-Electronics-datasheet-8324226.pdf?src-supplier=Future+Electronics; ComponentLink14URL: http://sigma.octopart.com:80/15940719/materials_sheet/Stackpole-Electronics-RMCF0603FT10K0.pdf?src-supplier=Compliance+Statements; ComponentLink14Description: http://sigma.octopart.com:80/15940719/materials_sheet/Stackpole-Electronics-RMCF0603FT10K0.pdf?src-supplier=Compliance+Statements; ComponentLink15URL: http://sigma.octopart.com:80/141158211/reach_statement/Stackpole-Electronics-RMCF0603FT10K0.pdf?src-supplier=Compliance+Statements; ComponentLink15Description: http://sigma.octopart.com:80/141158211/reach_statement/Stackpole-Electronics-RMCF0603FT10K0.pdf?src-supplier=Compliance+Statements; ComponentLink16URL: http://sigma.octopart.com:80/141158212/rohs_statement/Stackpole-Electronics-RMCF0603FT10K0.pdf?src-supplier=Compliance+Statements; ComponentLink16Description: http://sigma.octopart.com:80/141158212/rohs_statement/Stackpole-Electronics-RMCF0603FT10K0.pdf?src-supplier=Compliance+Statements
R16 = RES 330 OHM 1/10W 0603: 330 Ohms ±1% 0.1W, 1/10W Chip Resistor 0603 (1608 Metric) Thick Film; Manufacturer: TE Connectivity; Manufacturer Part Number: 1622918-1; Manufacturer Lifecycle Status: ACTIVE; Number of Resistors: 1; Operating Supply Voltage: 50V; Power Dissipation: 100mW; Temperature Coefficient: 100ppm/°C; Supplier: Farnell; Supplier Part Number: 3399578; RoHS: Compliant; Category: Chip SMD Resistors; Stock: 16155; Pricing: 10=0,0125, 250=0,0066, 1000=0,0044, 5000=0,0038, 10000=0,0028, 20000=0,0027 (EUR); Case/Package: 0603; Case Code (Imperial): 0603; Case Code (Metric): 1608; China RoHS: Non-Compliant; Composition: Thick Film; Depth: 800µm; ELV: Compliant; Height: 450µm; Length: 1.6mm; Lifecycle Status: Production; Max Operating Temperature: 125°C; Min Operating Temperature: -55°C; Mounting Technology: Surface Mount; Number of Terminals: 2; Number of Terminations: 2; Packaging: Tape & Reel (TR); Power Rating: 100mW; Radiation Hardening: No; REACH SVHC: Yes; Schedule B: 8533210045, 8533210090, 8533210090|8533210090, 8533210090|8533210090|8533210090; Termination: Solder; Tolerance: 1%; Voltage Rating: 50V; Width: 800µm; Working Voltage: 50V; ComponentLink1URL: https://datasheet.octopart.com:443/1622918-1-TE-Connectivity-datasheet-177732131.pdf?src-supplier=JRH+Electronics; ComponentLink1Description: https://datasheet.octopart.com:443/1622918-1-TE-Connectivity-datasheet-177732131.pdf?src-supplier=JRH+Electronics; ComponentLink2URL: https://datasheet.octopart.com:443/1622918-1-TE-Connectivity-datasheet-11120284.pdf?src-supplier=Farnell; ComponentLink2Description: https://datasheet.octopart.com:443/1622918-1-TE-Connectivity-datasheet-11120284.pdf?src-supplier=Farnell; ComponentLink3URL: https://datasheet.octopart.com:443/CRG0603F330R-TE-Connectivity-datasheet-182172479.pdf?src-supplier=IHS; ComponentLink3Description: https://datasheet.octopart.com:443/CRG0603F330R-TE-Connectivity-datasheet-182172479.pdf?src-supplier=IHS; ComponentLink4URL: https://datasheet.octopart.com:443/1622918-1-TE-Connectivity---AMP-datasheet-11120141.pdf?src-supplier=Master+Electronics; ComponentLink4Description: https://datasheet.octopart.com:443/1622918-1-TE-Connectivity---AMP-datasheet-11120141.pdf?src-supplier=Master+Electronics; ComponentLink5URL: https://datasheet.octopart.com:443/1622918-1-TE-Connectivity---AMP-datasheet-128558484.pdf?src-supplier=Master+Electronics; ComponentLink5Description: https://datasheet.octopart.com:443/1622918-1-TE-Connectivity---AMP-datasheet-128558484.pdf?src-supplier=Master+Electronics; ComponentLink6URL: https://datasheet.octopart.com:443/1622918-1-TE-Connectivity---AMP-datasheet-189108518.pdf?src-supplier=Master+Electronics; ComponentLink6Description: https://datasheet.octopart.com:443/1622918-1-TE-Connectivity---AMP-datasheet-189108518.pdf?src-supplier=Master+Electronics; ComponentLink7URL: https://datasheet.octopart.com:443/1622918-1-TE-Connectivity---AMP-datasheet-44624597.pdf?src-supplier=TE+Connectivity; ComponentLink7Description: https://datasheet.octopart.com:443/1622918-1-TE-Connectivity---AMP-datasheet-44624597.pdf?src-supplier=TE+Connectivity; ComponentLink8URL: https://datasheet.octopart.com:443/1622918-1-TE-Connectivity-datasheet-14513272.pdf?src-supplier=TE+Connectivity; ComponentLink8Description: https://datasheet.octopart.com:443/1622918-1-TE-Connectivity-datasheet-14513272.pdf?src-supplier=TE+Connectivity; ComponentLink9URL: https://datasheet.octopart.com:443/1622918-1-TE-Connectivity-datasheet-177731251.pdf?src-supplier=Burklin+Elektronik; ComponentLink9Description: https://datasheet.octopart.com:443/1622918-1-TE-Connectivity-datasheet-177731251.pdf?src-supplier=Burklin+Elektronik; ComponentLink10URL: https://datasheet.octopart.com:443/CRG0603F330R-TE-Connectivity-datasheet-111046813.pdf?src-supplier=RS+(Formerly+Allied+Electronics); ComponentLink10Description: https://datasheet.octopart.com:443/CRG0603F330R-TE-Connectivity-datasheet-111046813.pdf?src-supplier=RS+(Formerly+Allied+Electronics); ComponentLink11URL: https://datasheet.octopart.com:443/CRG0603F330R-TE-Connectivity-datasheet-20739855.pdf?src-supplier=RS+(Formerly+Allied+Electronics); ComponentLink11Description: https://datasheet.octopart.com:443/CRG0603F330R-TE-Connectivity-datasheet-20739855.pdf?src-supplier=RS+(Formerly+Allied+Electronics); ComponentLink12URL: https://datasheet.octopart.com:443/CRG0603F330R-Tyco-Electronics-datasheet-9643492.pdf?src-supplier=RS+(Formerly+Allied+Electronics); ComponentLink12Description: https://datasheet.octopart.com:443/CRG0603F330R-Tyco-Electronics-datasheet-9643492.pdf?src-supplier=RS+(Formerly+Allied+Electronics); ComponentLink13URL: http://sigma.octopart.com:80/14513267/rohs_certificate/Tyco-Electronics-CRG0603F330R.pdf?src-supplier=Compliance+Statements; ComponentLink13Description: http://sigma.octopart.com:80/14513267/rohs_certificate/Tyco-Electronics-CRG0603F330R.pdf?src-supplier=Compliance+Statements; ComponentLink14URL: http://sigma.octopart.com:80/38872715/materials_sheet/TE-Connectivity-CRG0603F330R.pdf?src-supplier=Compliance+Statements; ComponentLink14Description: http://sigma.octopart.com:80/38872715/materials_sheet/TE-Connectivity-CRG0603F330R.pdf?src-supplier=Compliance+Statements; ComponentLink15URL: http://sigma.octopart.com:80/78339115/materials_sheet/TE-Connectivity-CRG0603F330R.pdf?src-supplier=Compliance+Statements; ComponentLink15Description: http://sigma.octopart.com:80/78339115/materials_sheet/TE-Connectivity-CRG0603F330R.pdf?src-supplier=Compliance+Statements
R17 R18 = RES 120 OHM 1/10W 0603: 120 Ohms ±0.1% 0.1W, 1/10W Chip Resistor 0603 (1608 Metric) Automotive AEC-Q200 Thin Film; Manufacturer: Panasonic; Manufacturer Part Number: ERA3AEB121V; Max Power Dissipation: 100mW; Temperature Coefficient: 25ppm/°C; Voltage Rating: 75V; Supplier: Farnell; Supplier Part Number: 1811353; RoHS: Compliant; Category: Chip SMD Resistors; Stock: 35000; Pricing: 5000=0,0343 (EUR); Case/Package: 0603; Case Code (Imperial): 0603; Composition: Thin Film; Contact Plating: Tin; Depth: 800µm; Features: Automotive AEC-Q200; Height: 450µm; Lead Free: Lead Free; Length: 1.6mm; Lifecycle Status: Production; Max Operating Temperature: 155°C; Military Standard: Not; Min Operating Temperature: -55°C; Mounting Technology: Surface Mount; Pins: 2; Number of Terminals: 2; Number of Terminations: 2; Packaging: Cut Tape; Power Dissipation: 100mW; Power Rating: 100mW; Radiation Hardening: No; REACH SVHC: Yes; Schedule B: 8533210045, 8533210045|8533210045|8533210045|8533210045|8533210045; Termination: SMD/SMT; Tolerance: 0.1%; Voltage Rating (DC): 75V; Width: 800µm; Working Voltage: 75V; ComponentLink1URL: https://datasheet.octopart.com:443/ERA3AEB121V-Panasonic-datasheet-181959660.pdf?src-supplier=IHS; ComponentLink1Description: https://datasheet.octopart.com:443/ERA3AEB121V-Panasonic-datasheet-181959660.pdf?src-supplier=IHS; ComponentLink2URL: https://datasheet.octopart.com:443/ERA3AEB121V-Panasonic-datasheet-62287448.pdf?src-supplier=Farnell; ComponentLink2Description: https://datasheet.octopart.com:443/ERA3AEB121V-Panasonic-datasheet-62287448.pdf?src-supplier=Farnell; ComponentLink3URL: https://datasheet.octopart.com:443/ERA-3AEB121V-Panasonic-datasheet-118567.pdf?src-supplier=Farnell; ComponentLink3Description: https://datasheet.octopart.com:443/ERA-3AEB121V-Panasonic-datasheet-118567.pdf?src-supplier=Farnell; ComponentLink4URL: https://datasheet.octopart.com:443/ERA-3AEB121V-Panasonic---ECG-datasheet-15994758.pdf?src-supplier=Farnell; ComponentLink4Description: https://datasheet.octopart.com:443/ERA-3AEB121V-Panasonic---ECG-datasheet-15994758.pdf?src-supplier=Farnell; ComponentLink5URL: https://datasheet.octopart.com:443/ERA3AEB121V-Panasonic-datasheet-136531316.pdf?src-supplier=Newark; ComponentLink5Description: https://datasheet.octopart.com:443/ERA3AEB121V-Panasonic-datasheet-136531316.pdf?src-supplier=Newark; ComponentLink6URL: https://datasheet.octopart.com:443/ERA3AEB121V-Panasonic-datasheet-8367715.pdf?src-supplier=Newark; ComponentLink6Description: https://datasheet.octopart.com:443/ERA3AEB121V-Panasonic-datasheet-8367715.pdf?src-supplier=Newark; ComponentLink7URL: https://datasheet.octopart.com:443/ERA3AEB121V-Panasonic-datasheet-13266200.pdf?src-supplier=Newark; ComponentLink7Description: https://datasheet.octopart.com:443/ERA3AEB121V-Panasonic-datasheet-13266200.pdf?src-supplier=Newark; ComponentLink8URL: https://datasheet.octopart.com:443/ERA-3AEB121V-Panasonic-datasheet-12510007.pdf?src-supplier=Newark; ComponentLink8Description: https://datasheet.octopart.com:443/ERA-3AEB121V-Panasonic-datasheet-12510007.pdf?src-supplier=Newark; ComponentLink9URL: https://datasheet.octopart.com:443/ERA-3AEB121V-Panasonic-datasheet-11763931.pdf?src-supplier=Newark; ComponentLink9Description: https://datasheet.octopart.com:443/ERA-3AEB121V-Panasonic-datasheet-11763931.pdf?src-supplier=Newark; ComponentLink10URL: https://datasheet.octopart.com:443/ERA-3AEB121V-Panasonic-datasheet-10840895.pdf?src-supplier=Newark; ComponentLink10Description: https://datasheet.octopart.com:443/ERA-3AEB121V-Panasonic-datasheet-10840895.pdf?src-supplier=Newark; ComponentLink11URL: https://datasheet.octopart.com:443/ERA-3AEB121V-Panasonic-datasheet-5392808.pdf?src-supplier=Newark; ComponentLink11Description: https://datasheet.octopart.com:443/ERA-3AEB121V-Panasonic-datasheet-5392808.pdf?src-supplier=Newark; ComponentLink12URL: https://datasheet.octopart.com:443/ERA3AEB121V-Panasonic-datasheet-61114971.pdf?src-supplier=Newark; ComponentLink12Description: https://datasheet.octopart.com:443/ERA3AEB121V-Panasonic-datasheet-61114971.pdf?src-supplier=Newark; ComponentLink13URL: https://datasheet.octopart.com:443/ERA3AEB121V-Panasonic-datasheet-22087624.pdf?src-supplier=Newark; ComponentLink13Description: https://datasheet.octopart.com:443/ERA3AEB121V-Panasonic-datasheet-22087624.pdf?src-supplier=Newark; ComponentLink14URL: https://datasheet.octopart.com:443/ERA-3AEB121V-Panasonic-datasheet-154766165.pdf?src-supplier=Master+Electronics; ComponentLink14Description: https://datasheet.octopart.com:443/ERA-3AEB121V-Panasonic-datasheet-154766165.pdf?src-supplier=Master+Electronics; ComponentLink15URL: https://datasheet.octopart.com:443/ERA3AEB121V-Panasonic-datasheet-188913046.pdf?src-supplier=TME; ComponentLink15Description: https://datasheet.octopart.com:443/ERA3AEB121V-Panasonic-datasheet-188913046.pdf?src-supplier=TME; ComponentLink16URL: https://sigma.octopart.com:443/150570796/technical_drawing/Panasonic-ERA3AEB121V.pdf?src-supplier=Panasonic+SCT; ComponentLink16Description: https://sigma.octopart.com:443/150570796/technical_drawing/Panasonic-ERA3AEB121V.pdf?src-supplier=Panasonic+SCT; ComponentLink17URL: https://datasheet.octopart.com:443/ERA3AEB121V-Panasonic-datasheet-138783076.pdf?src-supplier=Burklin+Elektronik; ComponentLink17Description: https://datasheet.octopart.com:443/ERA3AEB121V-Panasonic-datasheet-138783076.pdf?src-supplier=Burklin+Elektronik; ComponentLink18URL: https://datasheet.octopart.com/ERA3AEB121V-Panasonic-datasheet-78375410.pdf; ComponentLink18Description: https://datasheet.octopart.com/ERA3AEB121V-Panasonic-datasheet-78375410.pdf; ComponentLink19URL: https://datasheet.octopart.com:443/ERA3AEB121V-Panasonic-datasheet-33006989.pdf?src-supplier=Electro+Sonic; ComponentLink19Description: https://datasheet.octopart.com:443/ERA3AEB121V-Panasonic-datasheet-33006989.pdf?src-supplier=Electro+Sonic; ComponentLink20URL: https://datasheet.octopart.com:443/ERA-3AEB121V-Panasonic-datasheet-46744048.pdf?src-supplier=Electro+Sonic; ComponentLink20Description: https://datasheet.octopart.com:443/ERA-3AEB121V-Panasonic-datasheet-46744048.pdf?src-supplier=Electro+Sonic
U4 = CH340E: USB Bridge, USB to UART USB 2.0 UART Interface 10-MSOP; Standards: USB 2.0; Voltage - Supply: 3V ~ 3.6V; Current - Supply: 20mA; Protocol: USB; Function: Bridge, USB to UART; Interface: UART; Operating Temperature: -20°C ~ 70°C (TA); Package / Case: 10-MSOP; ComponentLink1Description: Supplier Link; ComponentLink1URL: https://www.digikey.com/en/products/detail/sparkfun-electronics/16278/17829769; ComponentLink2Description: Datasheet; ComponentLink2URL: https://www.mpja.com/download/35227cpdata.pdf; Model: CH340E
U5 = MCP2562-H/SN: 1/1 Transceiver Half CANbus 8-SOIC; Manufacturer: Microchip; Data Rate: 1Mbps; Interface: CAN; Max Junction Temperature (Tj): 190°C; Max Supply Voltage: 5.5V; Min Supply Voltage: 1.8V; Nominal Supply Current: 70mA; Number of Transceivers: 1; Propagation Delay: 125ns; Supplier: Arrow Electronics; Manufacturer Part Number: MCP2562-H/SN; RoHS: Compliant; Category: CAN Transceivers; Stock: 200; Pricing: 200=0,9808 (USD); Projected EOL Date: 2039-03-19; Ambient Temperature Range High: 150°C; Case/Package: SOIC; Country of Assembly: Thailand; Country of Fabrication: Taiwan; Country of Origin: Thailand; Export Control Classification Number (ECCN) Code: EAR99; Height: 1.75mm; Harmonized Tariff Schedule (HTS) Code: 8542.39.0060; Introduction Date: 2013-03-19; Lead Free: Lead Free; Lifecycle Status: Production; Max Operating Temperature: 150°C; Min Operating Temperature: -40°C; Mounting Technology: Surface Mount; Pins: 8; Radiation Hardening: No; Schedule B: 8529906000; Turn-On Delay Time: 125ns; ComponentLink1URL: https://datasheet.octopart.com:443/MCP2562-H-SN-Microchip-datasheet-38190264.pdf?src-supplier=Microchip; ComponentLink1Description: https://datasheet.octopart.com:443/MCP2562-H-SN-Microchip-datasheet-38190264.pdf?src-supplier=Microchip; ComponentLink2URL: https://datasheet.octopart.com/MCP2562-H-SN-Microchip-datasheet-15670463.pdf; ComponentLink2Description: https://datasheet.octopart.com/MCP2562-H-SN-Microchip-datasheet-15670463.pdf; ComponentLink3URL: http://sigma.octopart.com:80/188449173/materials_sheet/Microchip-MCP2562-H-SN.pdf?src-supplier=Compliance+Statements; ComponentLink3Description: http://sigma.octopart.com:80/188449173/materials_sheet/Microchip-MCP2562-H-SN.pdf?src-supplier=Compliance+Statements; ComponentLink4URL: http://sigma.octopart.com:80/conflict_mineral_statement/Microchip-company-69.pdf?src-supplier=Compliance+Statements; ComponentLink4Description: http://sigma.octopart.com:80/conflict_mineral_statement/Microchip-company-69.pdf?src-supplier=Compliance+Statements; ComponentLink5URL: http://sigma.octopart.com:80/conflict_mineral_statement/Microchip-company-68.pdf?src-supplier=Compliance+Statements; ComponentLink5Description: http://sigma.octopart.com:80/conflict_mineral_statement/Microchip-company-68.pdf?src-supplier=Compliance+Statements; ComponentLink6URL: http://sigma.octopart.com:80/reach_statement/Microchip-company-70.pdf?src-supplier=Compliance+Statements; ComponentLink6Description: http://sigma.octopart.com:80/reach_statement/Microchip-company-70.pdf?src-supplier=Compliance+Statements; ComponentLink7URL: http://sigma.octopart.com:80/rohs_statement/Microchip-company-71.pdf?src-supplier=Compliance+Statements; ComponentLink7Description: http://sigma.octopart.com:80/rohs_statement/Microchip-company-71.pdf?src-supplier=Compliance+Statements; Supplier Part Number: MCP2562-H/SN